# Altium schematic sheet LedDuino.SchDoc
size A3; DocumentNumber: 1; SheetNumber: 1; SheetTotal: 2
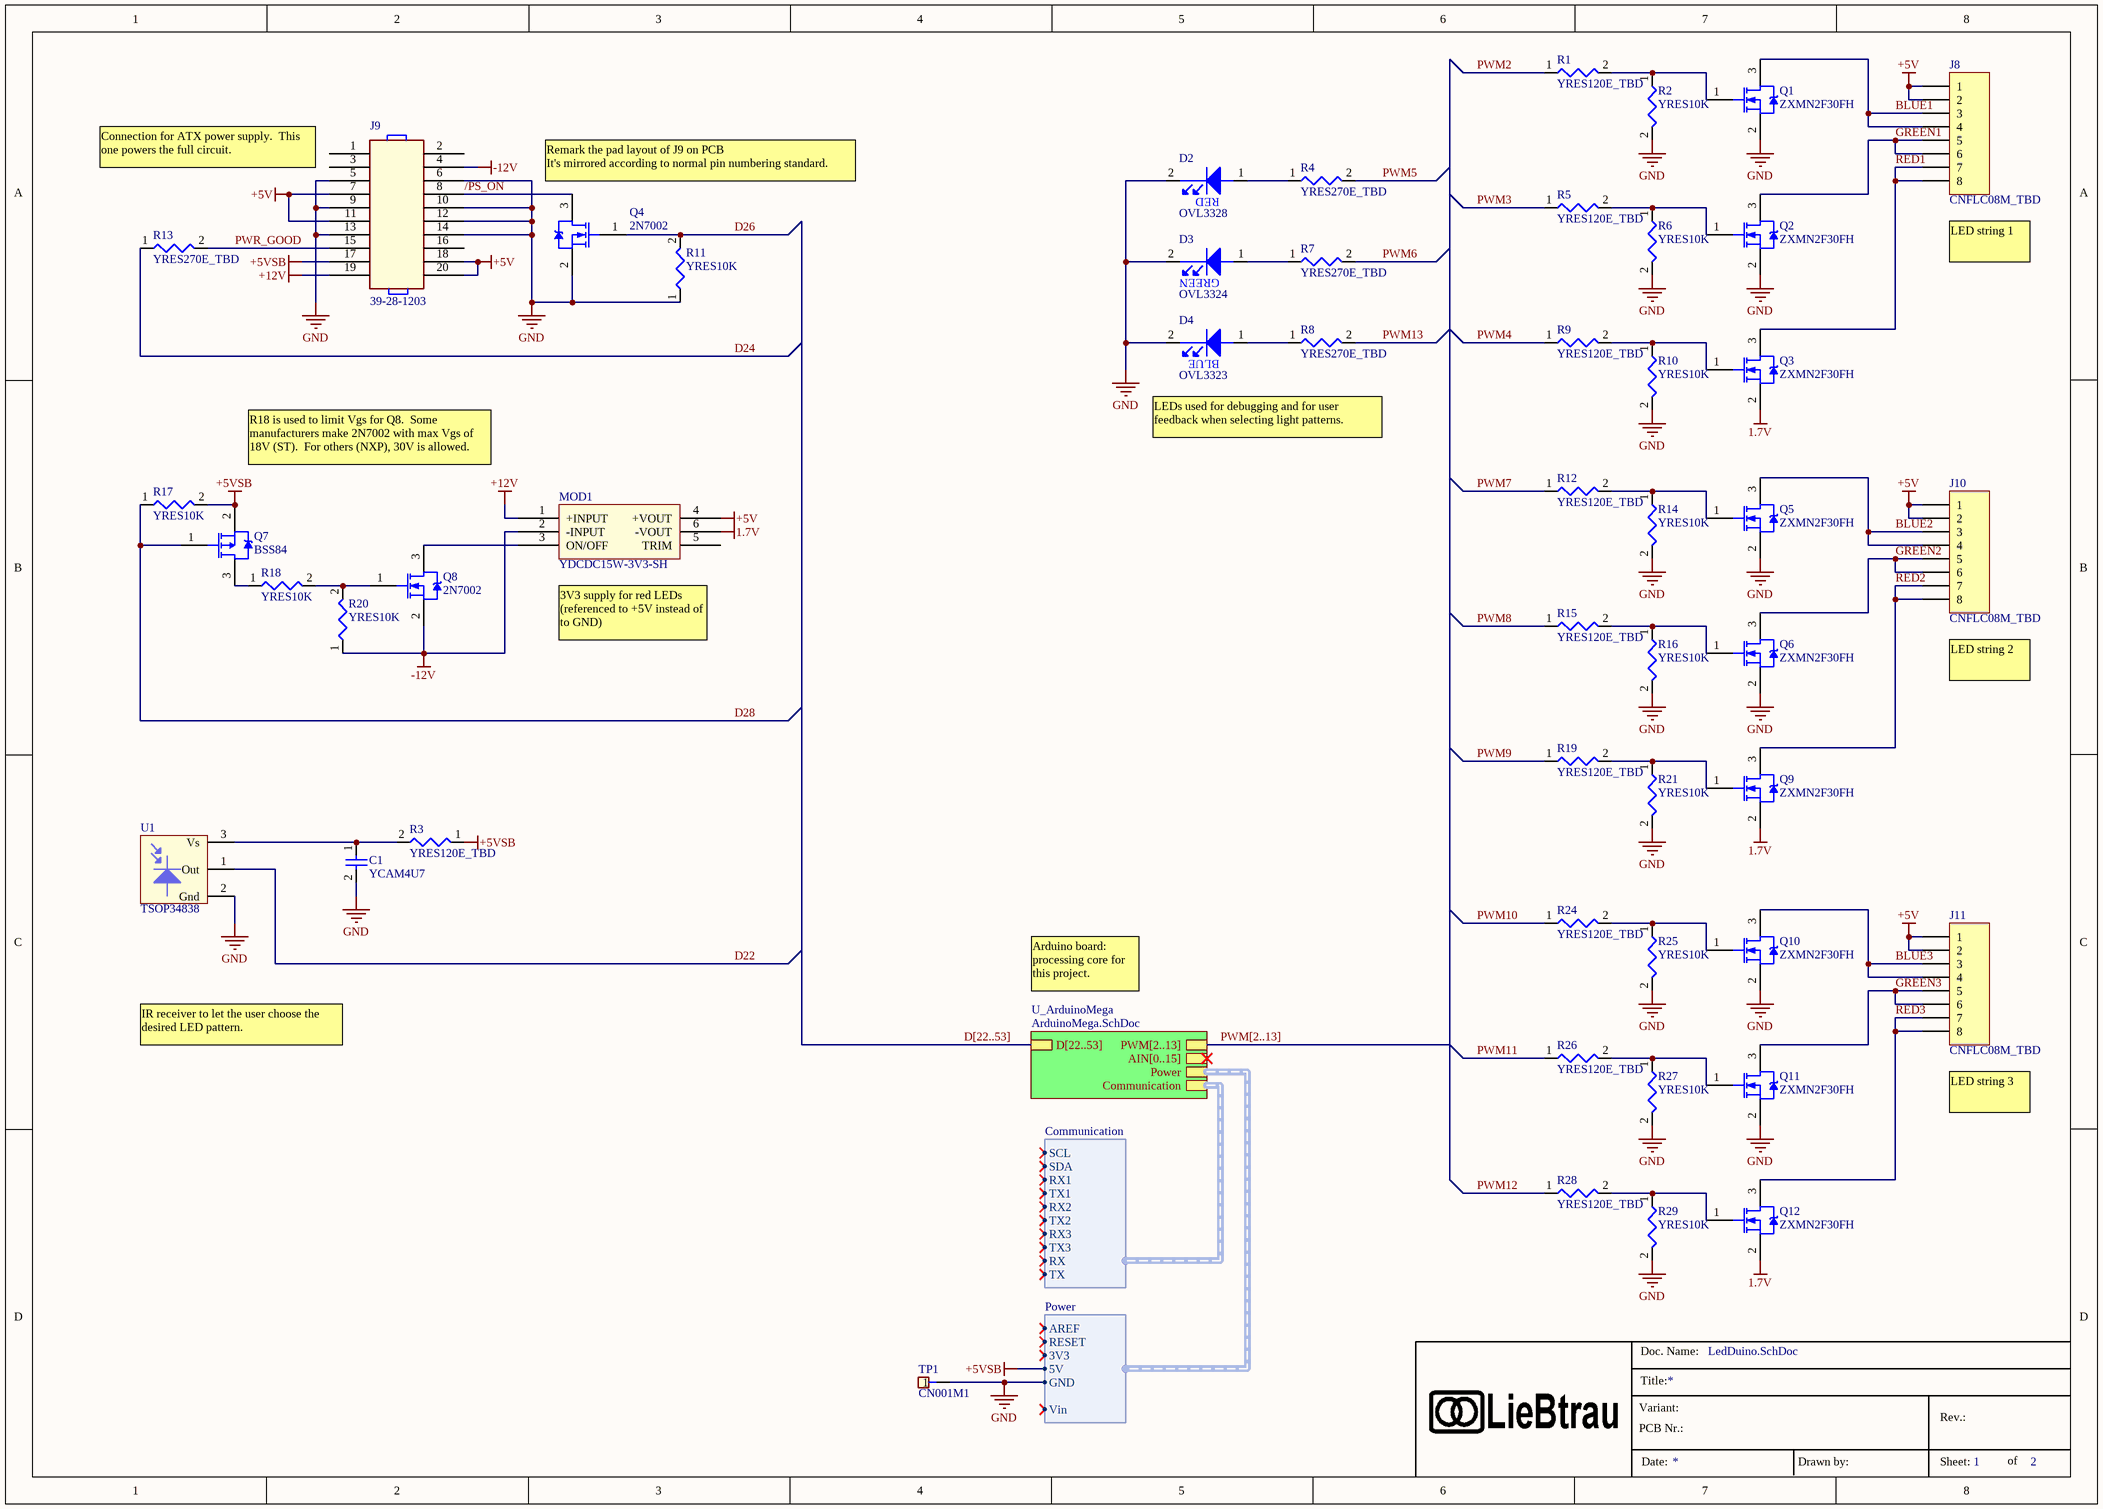
[diagram p0: LedDuino.SchDoc]

## Parts
C1  YCAM4U7  [C_1206]
D2  OVL3328  [D_LED3mm_straight]
D3  OVL3324  [D_LED3mm_straight]
D4  OVL3323  [D_LED3mm_straight]
J8  CNFLC08M_TBD  [J_215079-8]
J9  39-28-1203  [J_MiniFit_Jr_20P]
J10  CNFLC08M_TBD  [J_215079-8]
J11  CNFLC08M_TBD  [J_215079-8]
MOD1  YDCDC15W-3V3-SH  [MOD_DCDC_15W_TH]
Q1  ZXMN2F30FH  [SOT23]
Q2  ZXMN2F30FH  [SOT23]
Q3  ZXMN2F30FH  [SOT23]
Q4  2N7002  [SOT23]
Q5  ZXMN2F30FH  [SOT23]
Q6  ZXMN2F30FH  [SOT23]
Q7  BSS84  [SOT23]
Q8  2N7002  [SOT23]
Q9  ZXMN2F30FH  [SOT23]
Q10  ZXMN2F30FH  [SOT23]
Q11  ZXMN2F30FH  [SOT23]
Q12  ZXMN2F30FH  [SOT23]
R1  YRES120E_TBD  [R_1206]
R2  YRES10K  [R_1206]
R3  YRES120E_TBD  [R_1206]
R4  YRES270E_TBD  [R_1206]
R5  YRES120E_TBD  [R_1206]
R6  YRES10K  [R_1206]
R7  YRES270E_TBD  [R_1206]
R8  YRES270E_TBD  [R_1206]
R9  YRES120E_TBD  [R_1206]
R10  YRES10K  [R_1206]
R11  YRES10K  [R_1206]
R12  YRES120E_TBD  [R_1206]
R13  YRES270E_TBD  [R_1206]
R14  YRES10K  [R_1206]
R15  YRES120E_TBD  [R_1206]
R16  YRES10K  [R_1206]
R17  YRES10K  [R_1206]
R18  YRES10K  [R_1206]
R19  YRES120E_TBD  [R_1206]
R20  YRES10K  [R_1206]
R21  YRES10K  [R_1206]
R24  YRES120E_TBD  [R_1206]
R25  YRES10K  [R_1206]
R26  YRES120E_TBD  [R_1206]
R27  YRES10K  [R_1206]
R28  YRES120E_TBD  [R_1206]
R29  YRES10K  [R_1206]
TP1  CN001M1  [TP_TH_1.3mm]
U1  TSOP34838  [TSOP34XXX]

## Sub-sheets
U_ArduinoMega = ArduinoMega.SchDoc: Communication (harness Communication), Power (harness Power), D[22..53], AIN[0..15], PWM[2..13]

## Harnesses
Power: RESET, 3V3, 5V, GND, Vin, AREF
Communication: RX, TX, TX3, RX3, TX2, RX2, TX1, RX1, SDA, SCL

## Nets
1.7V: MOD1.6(-VOUT) Q3.2(S) Q9.2(S) Q12.2(S)
+5V: J8.1 J8.2 J9.7 J9.11 J9.18 J9.20 J10.1 J10.2 J11.1 J11.2 MOD1.4(+VOUT)
+5VSB: J9.17 Q7.2(S) R3.1 R17.2 ; sheet U_ArduinoMega/Power.5V
+12V: J9.19 MOD1.1(+INPUT)
-12V: J9.4 MOD1.2(-INPUT) Q8.2(S) R20.1
GND: C1.2 D2.2(C) D3.2(C) D4.2(C) J9.5 J9.6 J9.9 J9.10 J9.12 J9.13 J9.14 Q1.2(S) Q2.2(S) Q4.2(S) Q5.2(S) Q6.2(S) Q10.2(S) Q11.2(S) R2.2 R6.2 R10.2 R11.1 R14.2 R16.2 R21.2 R25.2 R27.2 R29.2 TP1.1 U1.2(Gnd) ; sheet U_ArduinoMega/Power.GND
/PS_ON: J9.8 Q4.3(D)
BLUE1: J8.3 J8.4 Q1.3(D)
BLUE2: J10.3 J10.4 Q5.3(D)
BLUE3: J11.3 J11.4 Q10.3(D)
D22: U1.1(Out)
D24: R13.1
D26: Q4.1(G) R11.2
D28: Q7.1(G) R17.1
GREEN1: J8.5 J8.6 Q2.3(D)
GREEN2: J10.5 J10.6 Q6.3(D)
GREEN3: J11.5 J11.6 Q11.3(D)
PWM2: R1.1
PWM3: R5.1
PWM4: R9.1
PWM5: R4.2
PWM6: R7.2
PWM7: R12.1
PWM8: R15.1
PWM9: R19.1
PWM10: R24.1
PWM11: R26.1
PWM12: R28.1
PWM13: R8.2
PWR_GOOD: J9.15 R13.2
RED1: J8.7 J8.8 Q3.3(D)
RED2: J10.7 J10.8 Q9.3(D)
RED3: J11.7 J11.8 Q12.3(D)
NetC1_1: C1.1 R3.2 U1.3(Vs)
NetD2_1: D2.1(A) R4.1
NetD3_1: D3.1(A) R7.1
NetD4_1: D4.1(A) R8.1
NetMOD1_3: MOD1.3(ON/OFF) Q8.3(D)
NetQ1_1: Q1.1(G) R1.2 R2.1
NetQ2_1: Q2.1(G) R5.2 R6.1
NetQ3_1: Q3.1(G) R9.2 R10.1
NetQ5_1: Q5.1(G) R12.2 R14.1
NetQ6_1: Q6.1(G) R15.2 R16.1
NetQ7_3: Q7.3(D) R18.1
NetQ8_1: Q8.1(G) R18.2 R20.2
NetQ9_1: Q9.1(G) R19.2 R21.1
NetQ10_1: Q10.1(G) R24.2 R25.1
NetQ11_1: Q11.1(G) R26.2 R27.1
NetQ12_1: Q12.1(G) R28.2 R29.1

Not connected (* = marked no-connect by the designer): J9 1 2 3 16; MOD1 5(TRIM)

## Buses and harness runs
bus D[22..53] = sheet U_ArduinoMega/D[22..53]
bus PWM[2..13] = sheet U_ArduinoMega/PWM[2..13]

## Notes on the sheet
- Connection for ATX power supply.  This one powers the full circuit.
- (near Q4) Remark the pad layout of J9 on PCB
  It's mirrored according to normal pin numbering standard.
- (near J8) LED string 1
- LEDs used for debugging and for user feedback when selecting light patterns.
- R18 is used to limit Vgs for Q8.  Some manufacturers make 2N7002 with max Vgs of 18V (ST).  For others (NXP), 30V is allowed.
- (near MOD1) 3V3 supply for red LEDs (referenced to +5V instead of to GND)
- (near J10) LED string 2
- Arduino board: processing core for this project.
- IR receiver to let the user choose the desired LED pattern.
- (near J11) LED string 3
- Title:
- Doc. Name:
- Variant:
- PCB Nr.:
- Date:
- Drawn by:
- Rev.:
- Sheet:
- of
- (in symbol OVL3323) BLUE
- (in symbol OVL3324) GREEN
- (in symbol OVL3328) RED

## Library data of the parts
D2 = OVL3328: Manufacturer: Multicomp; Order Code: Farnell 1716701; Part Number: OVL3328; Component Type: led
D3 = OVL3324: Manufacturer: Multicomp; Order Code: Farnell 1716698; Part Number: OVL3324; Component Type: led
D4 = OVL3323: Manufacturer: Multicomp; Order Code: Farnell 1716697; Part Number: OVL3323; Component Type: led
J8 J10 J11 = CNFLC08F_TBD: *; Order Code: Farnell 1641857; Part Number: CNFLC08F_TBD; Component Type: connector
J9 = 39-28-1203: Manufacturer: Molex; Order Code: Farnell 9734252; Part Number: 39-28-1203; Component Type: connector
Q1-Q3 Q5 Q6 Q9-Q12 = ZXMN2F30FH: Manufacturer: Zetex; Order Code: RS 708-2535; Part Number: ZXMN2F30FH; Component Type: transistor
Q4 Q8 = 2N7002: Order Code: Farnell 9845313RL; Part Number: 2N7002; Component Type: transistor
Q7 = BSS84: Order Code: Farnell 1094997; Part Number: BSS84; Component Type: transistor
R1 R3 R5 R9 R12 R15 R19 R24 R26 R28 = YRES120E_TBD: Resistor; Order Code: RS: 466-9568; Part Number: YRES120E_TBD; Component Type: resistor
R2 R6 R10 R11 R14 R16-R18 R20 R21 R25 R27 R29 = YRES10K: Resistor; Part Number: YRES10K; Component Type: resistor
R4 R7 R8 R13 = YRES270E_TBD: Resistor; Order Code: Farnell 1470003; Part Number: YRES270E_TBD; Component Type: resistor
U1 = TSOP34838: Manufacturer: Vishay; Order Code: Farnell 4913139; Part Number: TSOP34838; Component Type: ir receiver
C1 = YCAM4U7: Part Number: YCAM4U7; Component Type: capacitor
MOD1 = YDCDC15W-3V3-SH: Part Number: YDCDC15W-3V3-SH; Component Type: power
TP1 = CN001M1: Part Number: CN001M1